# Altium schematic sheet LCD - Copy.SchDoc
size A4; SheetNumber: 7; SheetTotal: 8
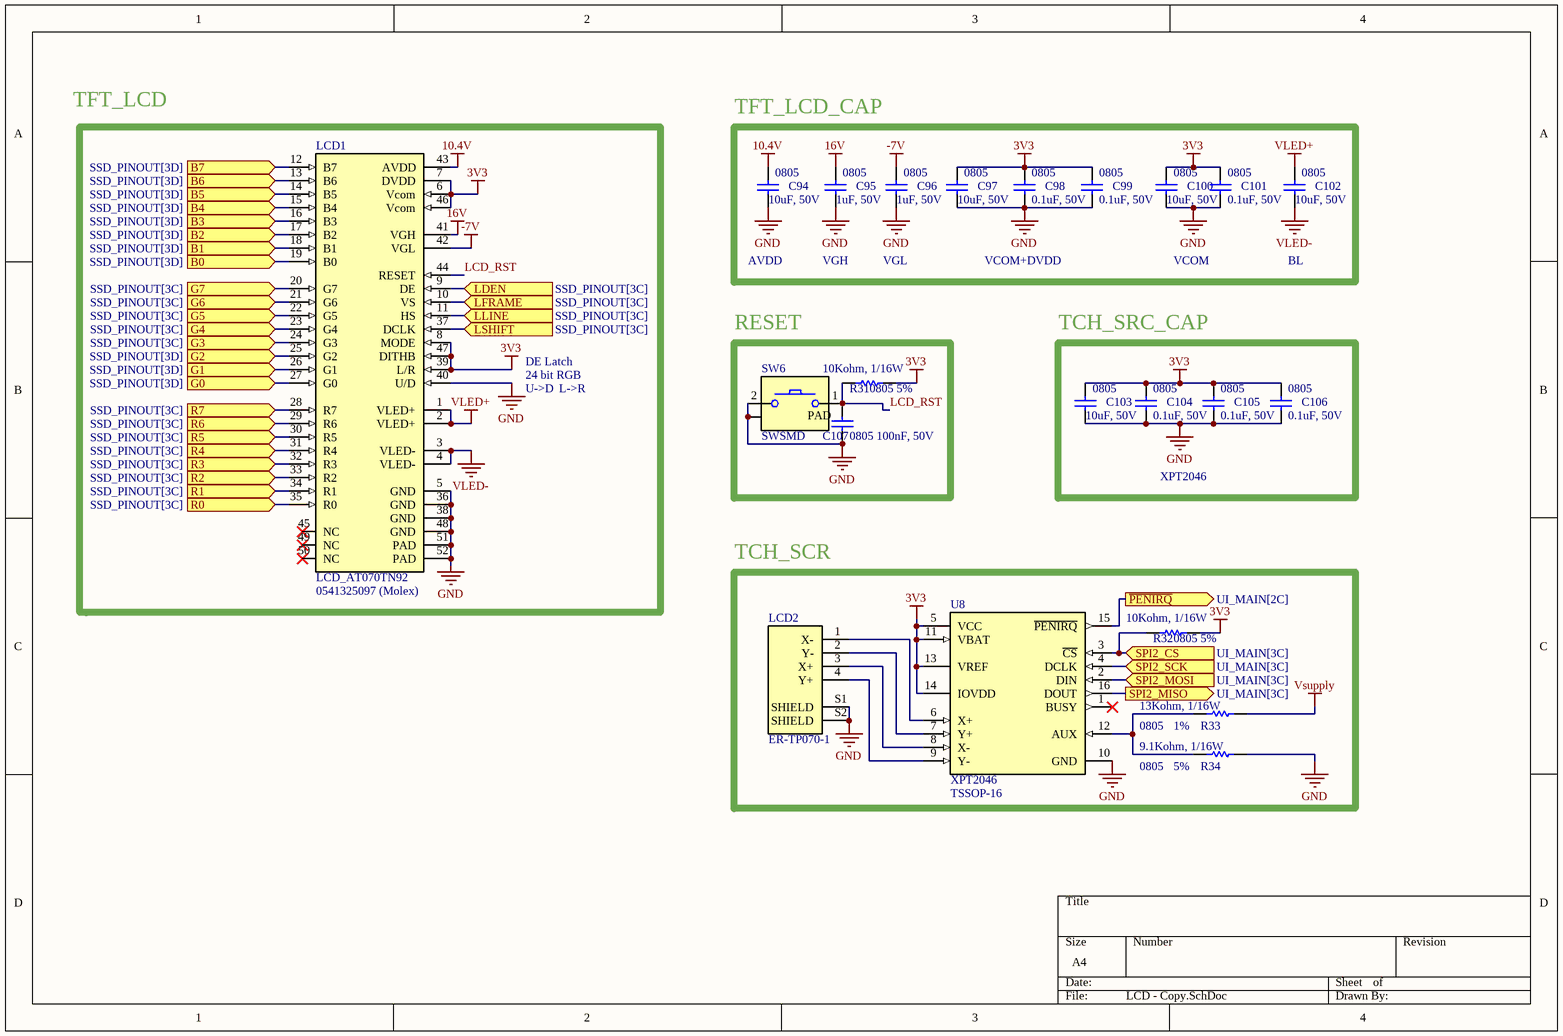
[diagram p0: LCD - Copy.SchDoc]

## Parts
C94  Package: 0805  [C_0805]  (hidden comment: 10uF, 50V)
C95  Package: 0805  [C_0805]  (hidden comment: 1uF, 50V)
C96  Package: 0805  [C_0805]  (hidden comment: 1uF, 50V)
C97  Package: 0805  [C_0805]  (hidden comment: 10uF, 50V)
C98  Package: 0805  [C_0805]  (hidden comment: 0.1uF, 50V)
C99  Package: 0805  [C_0805]  (hidden comment: 0.1uF, 50V)
C100  Package: 0805  [C_0805]  (hidden comment: 10uF, 50V)
C101  Package: 0805  [C_0805]  (hidden comment: 0.1uF, 50V)
C102  Package: 0805  [C_0805]  (hidden comment: 10uF, 50V)
C103  Package: 0805  [C_0805]  (hidden comment: 10uF, 50V)
C104  Package: 0805  [C_0805]  (hidden comment: 0.1uF, 50V)
C105  Package: 0805  [C_0805]  (hidden comment: 0.1uF, 50V)
C106  Package: 0805  [C_0805]  (hidden comment: 0.1uF, 50V)
C107  Package: 0805  [C_0805]  (hidden comment: 100nF, 50V)
LCD1  LCD_AT070TN92  Connector Part Number: 0541325097 (Molex)  [CONN_LCD_AT070TN90]
LCD2  ER-TP070-1  [ER-TP070-1]
R31  Package: 0805  Acc: 5%  [R_0805]  (hidden comment: 10Kohm, 1/16W)
R32  Package: 0805  Acc: 5%  [R_0805]  (hidden comment: 10Kohm, 1/16W)
R33  Package: 0805  Acc: 1%  [R_0805]  (hidden comment: 13Kohm, 1/16W)
R34  Package: 0805  Acc: 5%  [R_0805]  (hidden comment: 9.1Kohm, 1/16W)
SW6  SWSMD  [SW_SMD]
U8  XPT2046  Package: TSSOP-16  [PKG_TSSOP-16]

## Blocks framed on the sheet
TFT_LCD_CAP: C94-C102
RESET: C107 R31 SW6
TCH_SRC_CAP: C103-C106
TCH_SCR: LCD2 R32-R34 U8

## Ports
B0 (in, see SSD_PINOUT[3D]), B1 (in, see SSD_PINOUT[3D]), B2 (in, see SSD_PINOUT[3D]), B3 (in, see SSD_PINOUT[3D]), B4 (in, see SSD_PINOUT[3D]), B5 (in, see SSD_PINOUT[3D]), B6 (in, see SSD_PINOUT[3D]), B7 (in, see SSD_PINOUT[3D]), G0 (in, see SSD_PINOUT[3D]), G1 (in, see SSD_PINOUT[3D]), G2 (in, see SSD_PINOUT[3D]), G3 (in, see SSD_PINOUT[3C]), G4 (in, see SSD_PINOUT[3C]), G5 (in, see SSD_PINOUT[3C]), G6 (in, see SSD_PINOUT[3C]), G7 (in, see SSD_PINOUT[3C]), LDEN (in, see SSD_PINOUT[3C]), LFRAME (in, see SSD_PINOUT[3C]), LLINE (in, see SSD_PINOUT[3C]), LSHIFT (in, see SSD_PINOUT[3C]), R0 (in, see SSD_PINOUT[3C]), R1 (in, see SSD_PINOUT[3C]), R2 (in, see SSD_PINOUT[3C]), R3 (in, see SSD_PINOUT[3C]), R4 (in, see SSD_PINOUT[3C]), R5 (in, see SSD_PINOUT[3C]), R6 (in, see SSD_PINOUT[3C]), R7 (in, see SSD_PINOUT[3C]), SPI2_CS (in, see UI_MAIN[3C]), SPI2_MISO (out, see UI_MAIN[3C]), SPI2_MOSI (in, see UI_MAIN[3C]), SPI2_SCK (in, see UI_MAIN[3C]), ~{PENIRQ} (out, see UI_MAIN[2C])

## Nets
3V3: C97.2 C98.2 C99.2 C100.2 C101.2 C103.2 C104.2 C105.2 C106.2 LCD1.6(Vcom) LCD1.7(DVDD) LCD1.8(MODE) LCD1.39(L/R) LCD1.46(Vcom) LCD1.47(DITHB) R31.1 R32.1 U8.5(VCC) U8.11(VBAT) U8.13(VREF) U8.14(IOVDD)
10.4V: C94.2 LCD1.43(AVDD)
16V: C95.2 LCD1.41(VGH)
-7V: C96.2 LCD1.42(VGL)
GND: C94.1 C95.1 C96.1 C97.1 C98.1 C99.1 C100.1 C101.1 C103.1 C104.1 C105.1 C106.1 C107.1 LCD1.5(GND) LCD1.36(GND) LCD1.38(GND) LCD1.40(U/D) LCD1.48(GND) LCD1.51(PAD) LCD1.52(PAD) LCD2.S1(SHIELD) LCD2.S2(SHIELD) R34.1 SW6.0(PAD) SW6.2 U8.10(GND)
VLED+: C102.2 LCD1.1(VLED+) LCD1.2(VLED+)
VLED-: C102.1 LCD1.3(VLED-) LCD1.4(VLED-)
Vsupply: R33.1
B0: LCD1.19(B0) ; port B0
B1: LCD1.18(B1) ; port B1
B2: LCD1.17(B2) ; port B2
B3: LCD1.16(B3) ; port B3
B4: LCD1.15(B4) ; port B4
B5: LCD1.14(B5) ; port B5
B6: LCD1.13(B6) ; port B6
B7: LCD1.12(B7) ; port B7
G0: LCD1.27(G0) ; port G0
G1: LCD1.26(G1) ; port G1
G2: LCD1.25(G2) ; port G2
G3: LCD1.24(G3) ; port G3
G4: LCD1.23(G4) ; port G4
G5: LCD1.22(G5) ; port G5
G6: LCD1.21(G6) ; port G6
G7: LCD1.20(G7) ; port G7
LCD_RST: C107.2 LCD1.44(RESET) R31.2 SW6.1
LDEN: LCD1.9(DE) ; port LDEN
LFRAME: LCD1.10(VS) ; port LFRAME
LLINE: LCD1.11(HS) ; port LLINE
LSHIFT: LCD1.37(DCLK) ; port LSHIFT
~{PENIRQ}: U8.15(~{PENIRQ}) ; port ~{PENIRQ}
R0: LCD1.35(R0) ; port R0
R1: LCD1.34(R1) ; port R1
R2: LCD1.33(R2) ; port R2
R3: LCD1.32(R3) ; port R3
R4: LCD1.31(R4) ; port R4
R5: LCD1.30(R5) ; port R5
R6: LCD1.29(R6) ; port R6
R7: LCD1.28(R7) ; port R7
SPI2_CS: R32.2 U8.3(~{CS}) ; port SPI2_CS
SPI2_MISO: U8.16(DOUT) ; port SPI2_MISO
SPI2_MOSI: U8.2(DIN) ; port SPI2_MOSI
SPI2_SCK: U8.4(DCLK) ; port SPI2_SCK
NetLCD2_1: LCD2.1(X-) U8.6(X+)
NetLCD2_2: LCD2.2(Y-) U8.7(Y+)
NetLCD2_3: LCD2.3(X+) U8.8(X-)
NetLCD2_4: LCD2.4(Y+) U8.9(Y-)
NetR33_2: R33.2 R34.2 U8.12(AUX)

Not connected (* = marked no-connect by the designer): LCD1 45(NC)* 49(NC)* 50(NC)*; U8 1(BUSY)*

## Notes on the sheet
- TFT_LCD
- AVDD
- VGH
- VGL
- VCOM+DVDD
- VCOM
- BL
- DE Latch
- 24 bit RGB
- U->D
- L->R
- XPT2046

## Library data of the parts
C94-C107 = CAP_0805: Manufacturer 1: Vishay; Manufacturer Part Number 1: CAP0805; Supplier 1: Thegioiic; Datasheet: https://www.mouser.de/datasheet/2/447/PYu_RC_Group_51_RoHS_L_11-1984063.pdf; Supplier Link: N/a
  C94 C97 C100 C102 C103: Value: 10uF, 50V
  C95 C96: Value: 1uF, 50V
  C98 C99 C101 C104-C106: Value: 0.1uF, 50V
  C107: Value: 100nF, 50V
LCD1 = LCD_AT070TN92: LCD 7 inch (800 x 3(RGB) x 480) RES / __NOTE THAT THIS IS FFC 50PINS CONN w/ THE LCD FOOTPRINT!__; Manufacturer 1: INNOLUXDISPLAY Corp.; Manufacturer Part Number 1: AT070TN92; Supplier 1: Thegioiic (Out of stock); Datasheet: https://mm.digikey.com/Volume0/opasdata/d220001/medias/docus/530/AT070TN92_Jan12_2009_spec.pdf; Supplier Link: https://www.thegioiic.com/lcd-7inch-rbg-800x480-at070tn92-tft-rgb-innolux
LCD2 = ER-TP070-1: 7 ”Resistive Touch Panel; Manufacturer 1: EastRising; Manufacturer Part Number 1: ER-TP070-1; Supplier 1: trangiahcm; Datasheet: https://www.buydisplay.com/download/manual/ER-TFT070-2_Datasheet.pdf?srsltid=AfmBOoocyeKFVUV0E77nS_42dAg9JdCzPEYk2mMDtH1qp8-WkBG6DKe6; Supplier Link: https://trangiahcm.com/tam-cam-ung-cong-nghiep-7-0-inch-cap-4-chan-164-100-mm-152-86-mm--1740627184.html
R31-R34 = RES_0805: Manufacturer 1: Vishay; Manufacturer Part Number 1: RES0805; Supplier 1: Thegioiic; Datasheet: https://www.mouser.de/datasheet/2/447/PYu_RC_Group_51_RoHS_L_11-1984063.pdf; Supplier Link: N/a
  R31 R32: Value: 10Kohm, 1/16W
  R33: Value: 13Kohm, 1/16W
  R34: Value: 9.1Kohm, 1/16W
SW6 = SWSMD: SW_SMD; Manufacturer 1: OEM; Manufacturer Part Number 1: N/a; Supplier 1: Thegioiic; Datasheet: N/a; Supplier Link: https://www.thegioiic.com/nut-nhan-3x6mm-cao-3-5mm-4-chan-smd-chinh-ngang
U8 = XPT2046: 4-wire resistive touch screen controller that incorporates a 12-bit 125 kHz sampling SAR type / A/D converter; Manufacturer 1: SHENZHEN XPTEK TECHNOLOGY; Manufacturer Part Number 1: XPT2046; Supplier 1: icdayroi; Datasheet: https://grobotronics.com/images/datasheets/xpt2046-datasheet.pdf?srsltid=AfmBOorTYTw2TfTCyU1czP05-R0sff4j-Utx3ibrTtxtbedZOyGEQiyZ; Supplier Link: https://icdayroi.com/xpt2046